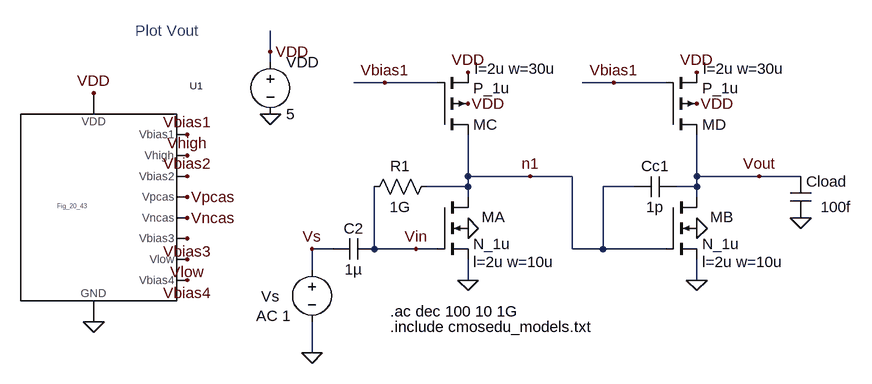
[diagram p0: schematic Fig21_32.asc]
Fig21_32.asc, the LTspice schematic file:
Version 4
SHEET 1 1976 680
WIRE 1072 -304 1072 -336
WIRE 1072 -288 1072 -304
WIRE 1248 -256 1200 -256
WIRE 1328 -256 1248 -256
WIRE 1600 -256 1552 -256
WIRE 1680 -256 1600 -256
WIRE 1376 -112 1376 -176
WIRE 1472 -112 1376 -112
WIRE 1536 -112 1472 -112
WIRE 1728 -112 1728 -176
WIRE 1824 -112 1728 -112
WIRE 1888 -112 1824 -112
WIRE 1376 -96 1376 -112
WIRE 1376 -96 1312 -96
WIRE 1632 -96 1584 -96
WIRE 1728 -96 1728 -112
WIRE 1728 -96 1696 -96
WIRE 1376 -80 1376 -96
WIRE 1728 -80 1728 -96
WIRE 1168 0 1136 0
WIRE 1232 0 1232 -96
WIRE 1296 0 1232 0
WIRE 1328 0 1296 0
WIRE 1536 0 1536 -112
WIRE 1584 0 1584 -96
WIRE 1584 0 1536 0
WIRE 1680 0 1584 0
WIRE 1136 32 1136 0
WIRE 1376 48 1376 16
WIRE 1728 48 1728 16
WIRE 1136 160 1136 112
FLAG 1072 -208 0
FLAG 1072 -304 VDD
FLAG 1376 -32 0
FLAG 1376 48 0
FLAG 1376 -272 VDD
FLAG 1376 -224 VDD
FLAG 800 -240 VDD
FLAG 800 112 0
FLAG 944 -176 Vbias1
FLAG 944 -144 Vhigh
FLAG 944 -112 Vbias2
FLAG 944 -16 Vbias3
FLAG 944 -80 Vpcas
FLAG 944 -48 Vncas
FLAG 944 48 Vbias4
FLAG 944 16 Vlow
FLAG 1136 160 0
FLAG 1296 0 Vin
FLAG 1248 -256 Vbias1
FLAG 1136 0 Vs
FLAG 1728 -32 0
FLAG 1728 48 0
FLAG 1728 -272 VDD
FLAG 1728 -224 VDD
FLAG 1824 -112 Vout
FLAG 1600 -256 Vbias1
FLAG 1888 -48 0
FLAG 1472 -112 n1
SYMBOL voltage 1072 -304 R0
WINDOW 123 0 0 Left 2
WINDOW 39 0 0 Left 2
SYMATTR InstName VDD
SYMATTR Value 5
SYMBOL nmos4 1328 -80 R0
WINDOW 123 56 100 Left 2
WINDOW 0 69 31 Left 2
SYMATTR Value2 l=2u w=10u
SYMATTR InstName MA
SYMATTR Value N_1u
SYMBOL pmos4 1328 -176 M180
WINDOW 123 58 102 Left 2
WINDOW 0 56 16 Left 2
SYMATTR Value2 l=2u w=30u
SYMATTR InstName MC
SYMATTR Value P_1u
SYMBOL Fig_20_43 800 -64 R0
SYMATTR InstName U1
SYMBOL voltage 1136 16 R0
WINDOW 123 -86 87 Left 2
WINDOW 39 0 0 Left 2
WINDOW 3 30 93 Left 2
WINDOW 0 -78 57 Left 2
SYMATTR Value2 AC 1
SYMATTR Value ""
SYMATTR InstName Vs
SYMBOL res 1216 -80 R270
WINDOW 0 32 56 VTop 2
WINDOW 3 0 56 VBottom 2
SYMATTR InstName R1
SYMATTR Value 1G
SYMBOL cap 1168 16 R270
WINDOW 0 32 32 VTop 2
WINDOW 3 0 32 VBottom 2
SYMATTR InstName C2
SYMATTR Value 1µ
SYMBOL nmos4 1680 -80 R0
WINDOW 123 56 100 Left 2
WINDOW 0 69 31 Left 2
SYMATTR Value2 l=2u w=10u
SYMATTR InstName MB
SYMATTR Value N_1u
SYMBOL pmos4 1680 -176 M180
WINDOW 123 58 102 Left 2
WINDOW 0 56 16 Left 2
SYMATTR Value2 l=2u w=30u
SYMATTR InstName MD
SYMATTR Value P_1u
SYMBOL cap 1632 -80 R270
WINDOW 0 32 32 VTop 2
WINDOW 3 0 32 VBottom 2
SYMATTR InstName Cc1
SYMATTR Value 1p
SYMBOL cap 1872 -112 R0
WINDOW 3 47 47 Left 2
SYMATTR Value 100f
SYMATTR InstName Cload
TEXT 1256 120 Left 2 !.include cmosedu_models.txt
TEXT 864 -336 Left 2 ;Plot Vout
TEXT 1256 96 Left 2 !.ac dec 100 10 1G

The netlist it stands for:
* Fig21_32.asc
VDD VDD 0 5
MA n1 Vin 0 0 N_1u l=2u w=10u
MC n1 Vbias1 VDD VDD P_1u l=2u w=30u
XU1 Vbias1 Vhigh Vbias2 Vpcas Vncas Vbias3 Vlow Vbias4 VDD 0 Fig_20_43  ; pins Vbias1 Vhigh Vbias2 Vpcas Vncas Vbias3 Vlow Vbias4 VDD GND
Vs Vs 0 AC 1
R1 Vin n1 1G
C2 Vs Vin 1µ
MB Vout n1 0 0 N_1u l=2u w=10u
MD Vout Vbias1 VDD VDD P_1u l=2u w=30u
Cc1 n1 Vout 1p
Cload Vout 0 100f
.model NMOS NMOS
.model PMOS PMOS
.lib standard.mos
.include cmosedu_models.txt
* Plot Vout
.ac dec 100 10 1G
.backanno
.end